# EAGLE design untitled (EAGLE 9.1.3)
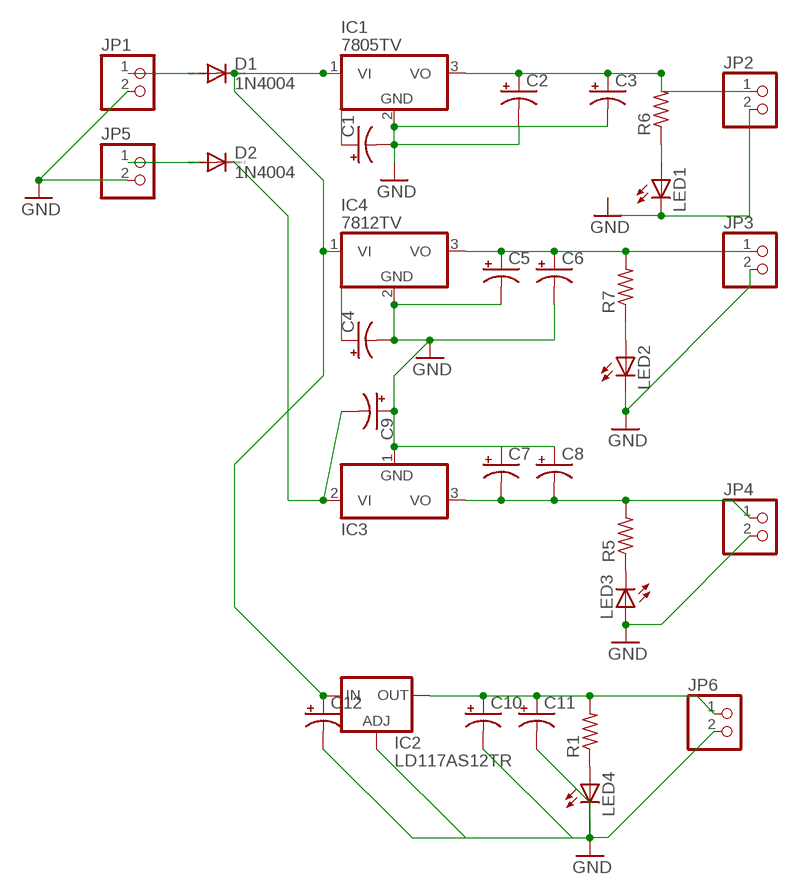
[diagram p0: schematic, sheet 1]

## Parts
C1  CPOL-USE2.5-5  [E2,5-5]
C2  CPOL-USE2.5-5  [E2,5-5]
C3  CPOL-USE2.5-5  [E2,5-5]
C4  CPOL-USE2.5-5  [E2,5-5]
C5  CPOL-USE2.5-5  [E2,5-5]
C6  CPOL-USE2.5-5  [E2,5-5]
C7  CPOL-USE2.5-5  [E2,5-5]
C8  CPOL-USE2.5-5  [E2,5-5]
C9  CPOL-USE2.5-5  [E2,5-5]
C10  CPOL-USE2.5-5  [E2,5-5]
C11  CPOL-USE2.5-5  [E2,5-5]
C12  CPOL-USE2.5-5  [E2,5-5]
D1  1N4004  [DO41-10]
D2  1N4004  [DO41-10]
IC1  7805TV  [TO220V]
IC2  LD117AS12TR  [SOT223]
IC3  7912T  [TO220H]
IC4  7812TV  [TO220V]
JP1  PINHD-1X2  [1X02]
JP2  PINHD-1X2  [1X02]
JP3  PINHD-1X2  [1X02]
JP4  PINHD-1X2  [1X02]
JP5  PINHD-1X2  [1X02]
JP6  PINHD-1X2  [1X02]
LED1  LED3MM  [LED3MM]
LED2  LED3MM  [LED3MM]
LED3  LED3MM  [LED3MM]
LED4  LED3MM  [LED3MM]
R1  R-US_R1206  [R1206]
R5  R-US_R1206  [R1206]
R6  R-US_R1206  [R1206]
R7  R-US_R1206  [R1206]

## Nets
GND: C1.- C2.- C3.- C4.- C5.- C6.- C7.+ C8.+ C9.+ C10.- C11.- C12.- IC1.2(GND) IC2.1(ADJ) IC3.1(GND) IC4.2(GND) JP1.2 JP2.2 JP3.2 JP4.2 JP5.2 JP6.2 LED1.K(C) LED2.K(C) LED3.A LED4.K(C)
N$1: D1.A JP1.1
N$2: C9.- D2.C IC3.2(VI)
N$3: D2.A JP5.1
N$4: LED4.A R1.1
N$5: LED1.A R6.1
N$6: C2.+ C3.+ IC1.3(VO) JP2.1 R6.2
N$7: C5.+ C6.+ IC4.3(VO) JP3.1 R7.2
N$8: LED2.A R7.1
N$9: LED3.K(C) R5.1
N$10: C7.- C8.- IC3.3(VO) JP4.1 R5.2
N$11: C1.+ C4.+ C12.+ D1.C IC1.1(VI) IC2.3(IN) IC4.1(VI)
N$12: C10.+ C11.+ IC2.4(OUT) JP6.1 R1.2

## Library data of the parts
C1-C12 = rcl:CPOL-US: POLARIZED CAPACITOR, American symbol; SPICEPREFIX: C
D1 D2 = diode:1N4004: DIODE general purpose rectifier, 1 A
IC1 IC4 = linear:78*: Positive VOLTAGE REGULATOR Source: http://cache.national.com/ds/LM/LM78L05.pdf http://www.fairchildsemi.com/ds/LM/LM7805.pdf
IC2 = v-reg:LD117A?*: Low drop fixed and adjustable positive voltage regulators 1 A Source: http://www.st.com/stonline/products/literature/ds/7194/ld1117axx.pdf
IC3 = linear:79*: Negative VOLTAGE REGULATOR
JP1-JP6 = pinhead:PINHD-1X2: PIN HEADER
LED1-LED4 = led:LED: LED OSRAM: - CHIPLED LG R971, LG N971, LY N971, LG Q971, LY Q971, LO R971, LY R971 LH N974, LH R974 LS Q976, LO Q976, LY Q976 LO Q996 - Hyper CHIPLED LW Q18S LB Q993, LB Q99A, LB R99A - SideLED LS A670, LO A670, LY A670, LG A670, LP A670 LB A673, LV A673, LT A673, LW A673 LH A674 LY A675 LS A676, LA A676, LO A676, LY A676, LW A676 LS A679, LY A679, LG A679 - Hyper Micro SIDELED® LS Y876, LA Y876, LO Y876, LY Y876 LT Y87S - SmartLED LW L88C, LW L88S LB L89C, LB L89S, LG L890 LS L89K, LO L89K, LY L89K LS L896, LA L896, LO L896, LY L896 - TOPLED LS T670, LO T670, LY T670, LG T670, LP T670 LSG T670, LSP T670, LSY T670, LOP T670, LYG T670 LG T671, LOG T671, LSG T671 LB T673, LV T673, LT T673, LW T673 LH T674 LS T676, LA T676, LO T676, LY T676, LB T676, LH T676, LSB T676, LW T676 LB T67C, LV T67C, LT T67C, LS T67K, LO T67K, LY T67K, LW E67C LS E67B, LA E67B, LO E67B, LY E67B, LB E67C, LV E67C, LT E67C LW T67C LS T679, LY T679, LG T679 LS T770, LO T770, LY T770, LG T770, LP T770 LB T773, LV T773, LT T773, LW T773 LH T774 LS E675, LA E675, LY E675, LS T675 LS T776, LA T776, LO T776, LY T776, LB T776 LHGB T686 LT T68C, LB T68C - Hyper Mini TOPLED® LB M676 - Mini TOPLED Santana® LG M470 LS M47K, LO M47K, LY M47K Source: http://www.osram.convergy.de LUXEON: - LUMILED® LXK2-PW12-R00, LXK2-PW12-S00, LXK2-PW14-U00, LXK2-PW14-V00 LXK2-PM12-R00, LXK2-PM12-S00, LXK2-PM14-U00 LXK2-PE12-Q00, LXK2-PE12-R00, LXK2-PE12-S00, LXK2-PE14-T00, LXK2-PE14-U00 LXK2-PB12-K00, LXK2-PB12-L00, LXK2-PB12-M00, LXK2-PB14-N00, LXK2-PB14-P00, LXK2-PB14-Q00 LXK2-PR12-L00, LXK2-PR12-M00, LXK2-PR14-Q00, LXK2-PR14-R00 LXK2-PD12-Q00, LXK2-PD12-R00, LXK2-PD12-S00 LXK2-PH12-R00, LXK2-PH12-S00 LXK2-PL12-P00, LXK2-PL12-Q00, LXK2-PL12-R00 Source: www.luxeon.com KINGBRIGHT: KA-3528ASYC Source: www.kingbright.com
R1 R5-R7 = rcl:R-US_: RESISTOR, American symbol; SPICEPREFIX: R

## Board
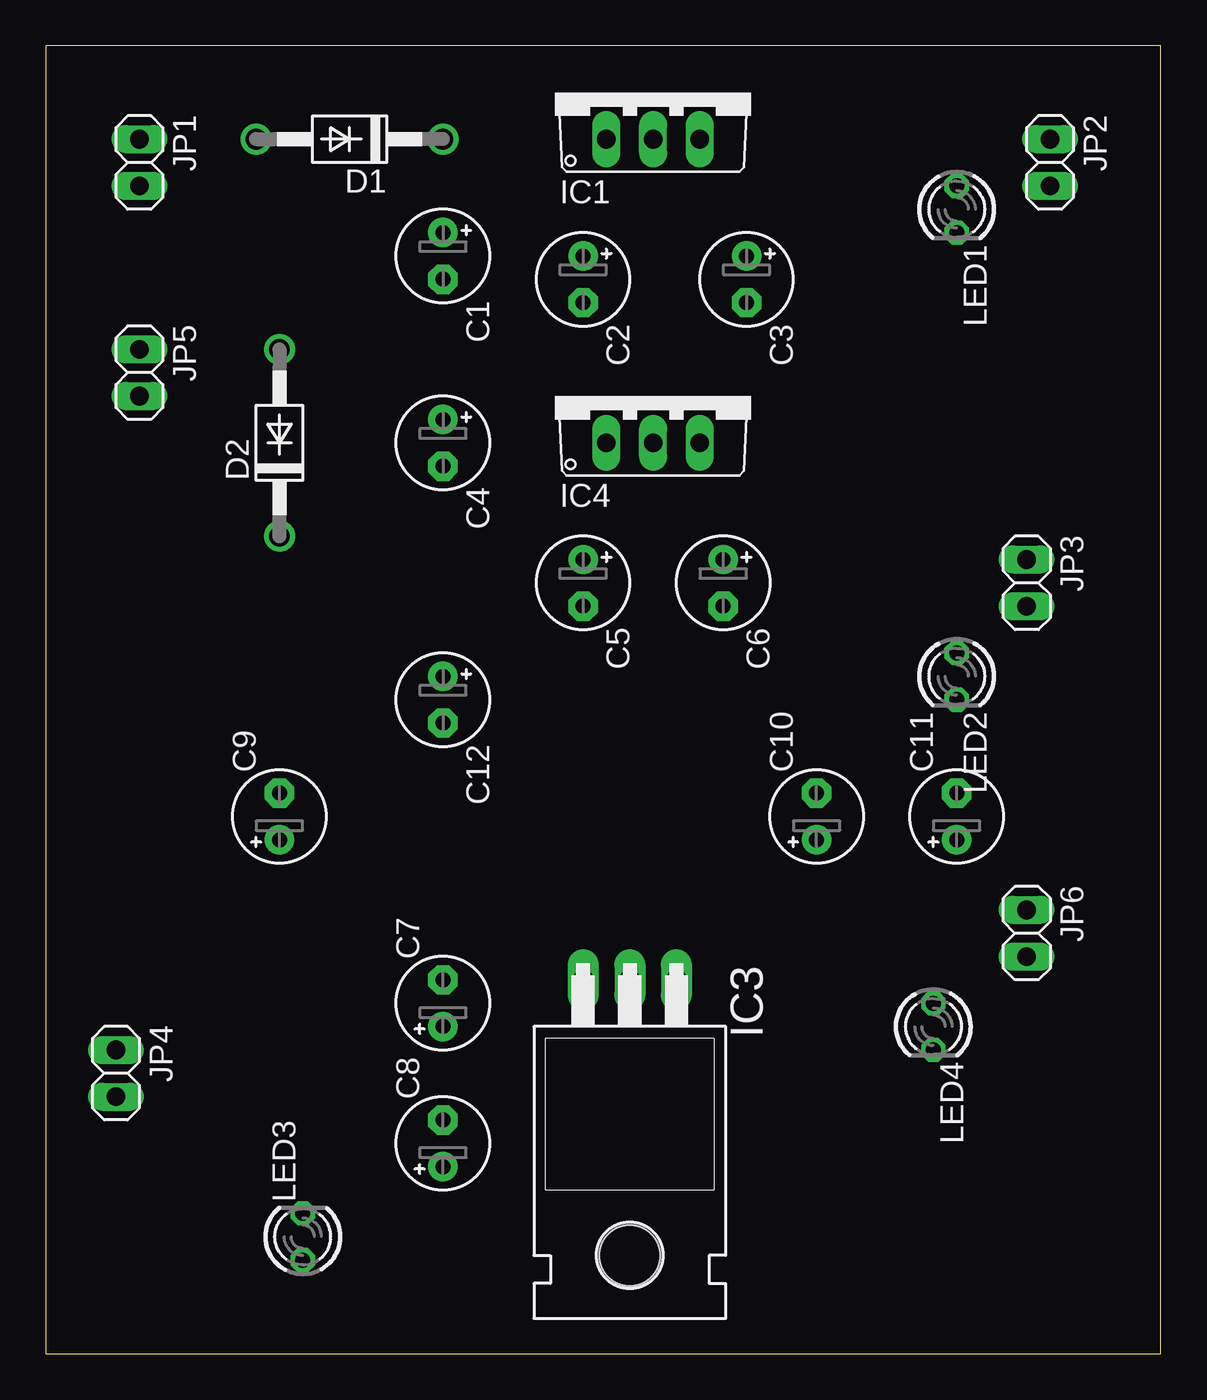
[diagram p1: board, top side]
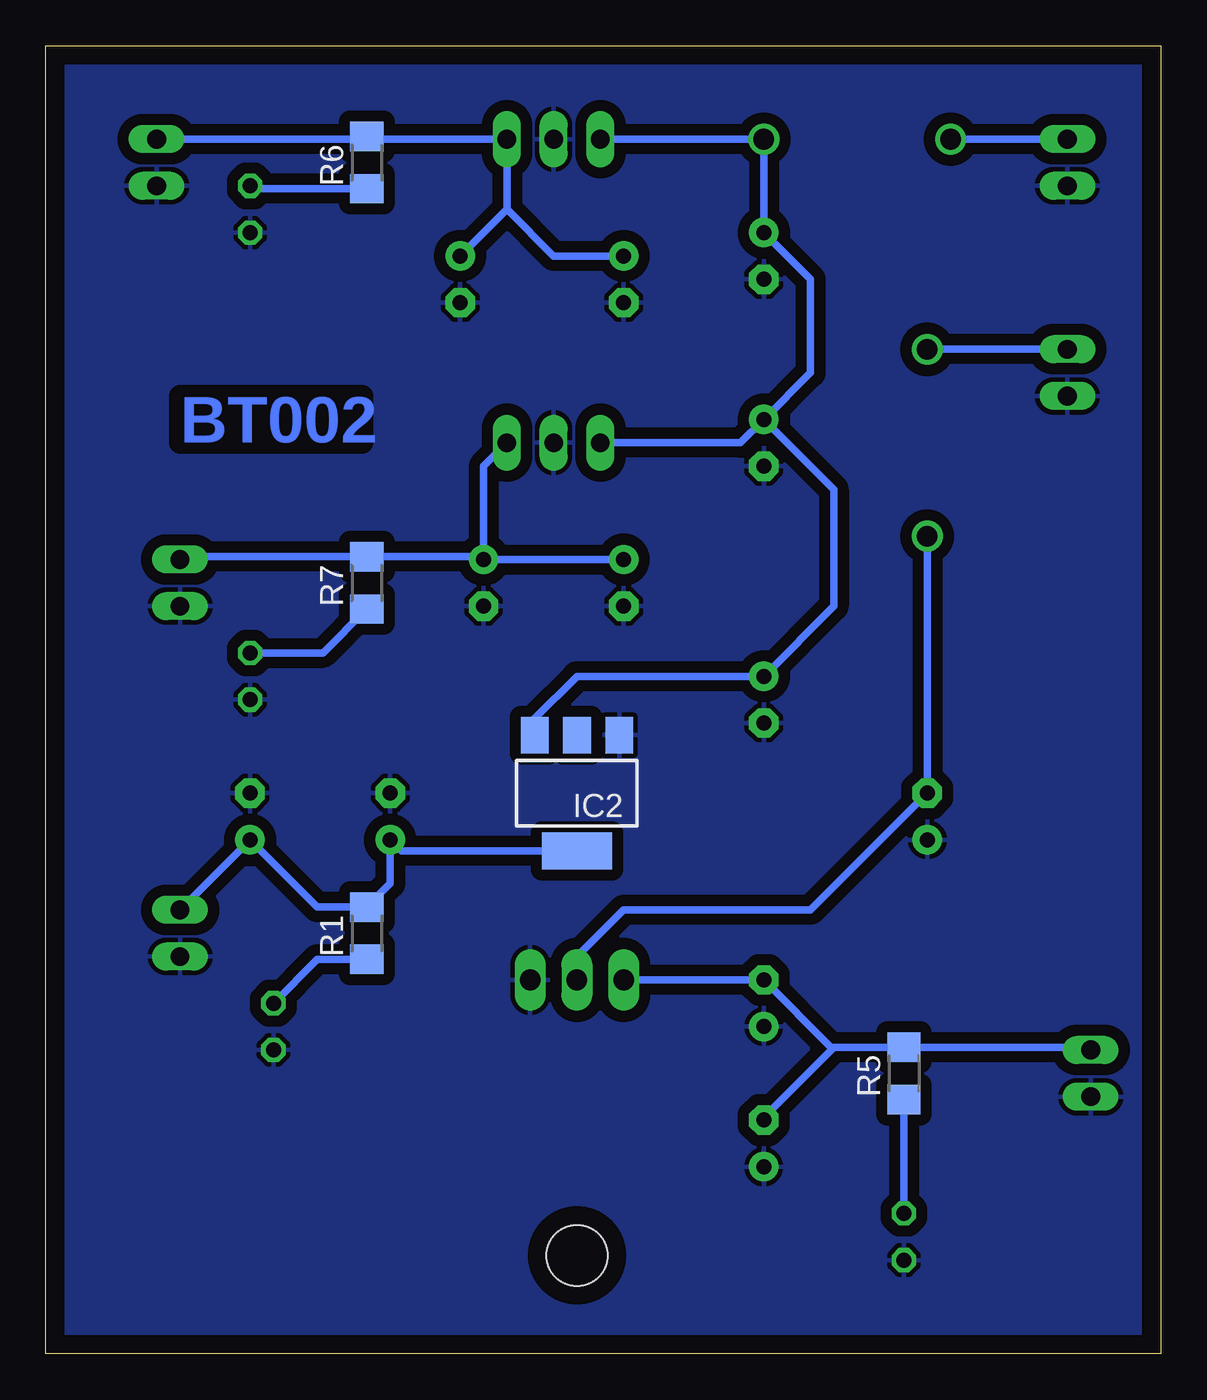
[diagram p2: board, bottom side, seen from below]

Size 60.63 x 71.11 mm. Coordinates in mm from the lower left corner, seen from the top.
Outline: 0,0 60.63,0 60.63,71.11 0,71.11 0,0
Copper layers (1*16): Top 0.035mm / dielectric 1.5mm / Bottom 0.035mm
Design rules "default *": minimum track width 6mil, minimum drill 0.35mm, track to track 24mil, track to pad 24mil, pad to pad 24mil, via to via 24mil, smd to smd 24mil, copper to edge 40mil, drill to drill 6mil, minimum pad ring 10mil, minimum via ring 8mil, stop-mask expansion 4mil, vias tented up to drill 0mil, thermal gap 10mil

### Footprints (pad centres in the part's own frame; a part is rotated, then mirrored left to right if it is on the bottom)
E2,5-5 = drill 0.813 pad 1.6: + -1.27,0 | drill 0.813 pad 1.6 octagon: - 1.27,0
DO41-10 = drill 1.118: A 5.08,0; C -5.08,0
TO220V = drill 1.016 long: 1 -2.54,-2.54; 2 0,-2.54; 3 2.54,-2.54
SOT223 = smd 1.5 x 2: 1 -2.3,-3.15; 2 0,-3.15; 3 2.3,-3.15 | smd 3.8 x 2: 4 0,3.15
TO220H = drill 1.118 long: 1 -2.54,-10.16; 2 0,-10.16; 3 2.54,-10.16 | hole 3.302: 0,4.826
1X02 = drill 1.016 long: 1 -1.27,0; 2 1.27,0
LED3MM = drill 0.813 octagon: A -1.27,0; K 1.27,0
R1206 = smd 1.6 x 1.803: 1 -1.422,0; 2 1.422,0

### Placement (x,y rotation side)
C1  21.59,59.69 270 top
C2  29.21,58.42 270 top
C3  38.1,58.42 270 top
C4  21.59,49.53 270 top
C5  29.21,41.91 270 top
C6  36.83,41.91 270 top
C7  21.59,19.05 90 top
C8  21.59,11.43 90 top
C9  12.7,29.21 90 top
C10  41.91,29.21 90 top
C11  49.53,29.21 90 top
C12  21.59,35.56 270 top
D1  16.51,66.04 180 top
D2  12.7,49.53 90 top
IC1  33.02,68.58 0 top
IC2  31.75,30.48 180 bottom
IC3  31.75,10.16 180 top
IC4  33.02,52.07 0 top
JP1  5.08,64.77 270 top
JP2  54.61,64.77 270 top
JP3  53.34,41.91 270 top
JP4  3.81,15.24 270 top
JP5  5.08,53.34 270 top
JP6  53.34,22.86 270 top
LED1  49.53,62.23 270 top
LED2  49.53,36.83 270 top
LED3  13.97,6.35 90 top
LED4  48.26,17.78 270 top
R1  43.18,22.86 90 bottom
R5  13.97,15.24 90 bottom
R6  43.18,64.77 90 bottom
R7  43.18,41.91 90 bottom

### Tracks (layer width: path | path; a pad name or v marks a point on that pad's centre or on a via)
GND
  pour Bottom: -3.81,74.93 72.39,74.93 72.39,-10.16 71.12,-11.43 -6.35,-11.43 -6.35,72.39
N$1
  Bottom 0.406: JP1.1 D1.A
N$2
  Bottom 0.406: D2.C C9.- 19.05,24.13 29.21,24.13 31.75,21.59 IC3.2
N$3
  Bottom 0.406: JP5.1 D2.A
N$4
  Bottom 0.406: R1.1 45.87,21.44 LED4.A
N$5
  Bottom 0.406: R6.1 49.38,63.35 LED1.A
N$6
  Bottom 0.406: IC1.3 JP2.1 | IC1.3 43.03,66.04 R6.2 | IC1.3 35.56,62.23 | 35.56,62.23 C3.+ | C2.+ 33.02,59.69 35.56,62.23
N$7
  Bottom 0.406: IC4.3 36.83,48.26 C6.+ | C6.+ C5.+ | C6.+ 36.98,43.33 R7.2 53.19,43.33 JP3.1
N$8
  Bottom 0.406: LED2.A 45.57,38.1 R7.1
N$9
  Bottom 0.406: R5.1 LED3.K
N$10
  Bottom 0.406: 17.78,16.66 R5.2 3.96,16.66 JP4.1 | 17.78,16.66 17.93,16.66 C7.- IC3.3 | 17.78,16.66 21.59,12.85 C8.-
N$11
  Bottom 0.406: IC1.1 D1.C C1.+ 19.05,58.42 19.05,53.34 C4.+ | C4.+ 17.78,46.99 17.78,40.64 C12.+ 31.75,36.83 34.05,34.53 IC2.3 | C4.+ 22.86,49.53 IC4.1
N$12
  Bottom 0.406: IC2.4 41.3,27.33 C10.+ 41.91,25.55 R1.2 45.87,24.28 C11.+ JP6.1

### Text on the board
Bottom: BT002